# EAGLE design ethernet_board (EAGLE 7.2.0)
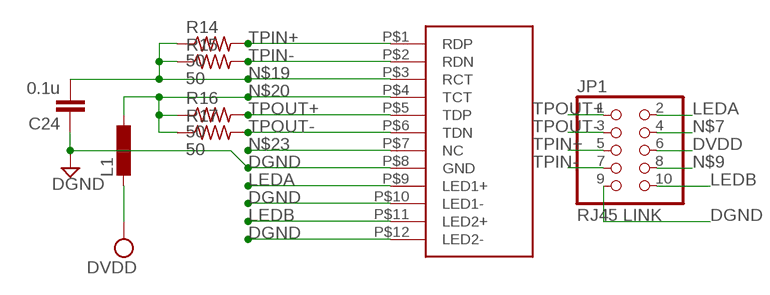
[diagram p0: schematic, sheet 1]

## Parts
C24  0.1u  C-EUC0805  [C0805]
JP1  RJ45 LINK  PINHD-2X5/90  [2X05/90]
L1  L-EU0207/10  [0207/10]
R14  50  R-US_R1206  [R1206]
R15  50  R-US_R1206  [R1206]
R16  50  R-US_R1206  [R1206]
R17  50  R-US_R1206  [R1206]
U$5  RJ45  TYCO-RJ45  [TYCO-RJ45]

## Nets
DGND: C24.1 JP1.9 U$5.P$8(GND) U$5.P$10(LED1-) U$5.P$12(LED2-)
DVDD: JP1.6 L1.2
LEDA: JP1.2 U$5.P$9(LED1+)
LEDB: JP1.10 U$5.P$11(LED2+)
N$7: JP1.4
N$9: JP1.8
N$19: C24.2 R14.1 R15.1 U$5.P$3(RCT)
N$20: L1.1 R16.1 R17.1 U$5.P$4(TCT)
N$23: U$5.P$7(NC)
TPIN+: JP1.5 R14.2 U$5.P$1(RDP)
TPIN-: JP1.7 R15.2 U$5.P$2(RDN)
TPOUT+: JP1.1 R16.2 U$5.P$5(TDP)
TPOUT-: JP1.3 R17.2 U$5.P$6(TDN)

## Library data of the parts
C24 = rcl:C-EU: CAPACITOR, European symbol
JP1 = pinhead:PINHD-2X5: PIN HEADER
L1 = rcl:L-EU: INDUCTOR, European symbol
R14-R17 = rcl:R-US_: RESISTOR, American symbol
U$5 = Radio_IP_PCB:TYCO-RJ45

## Board
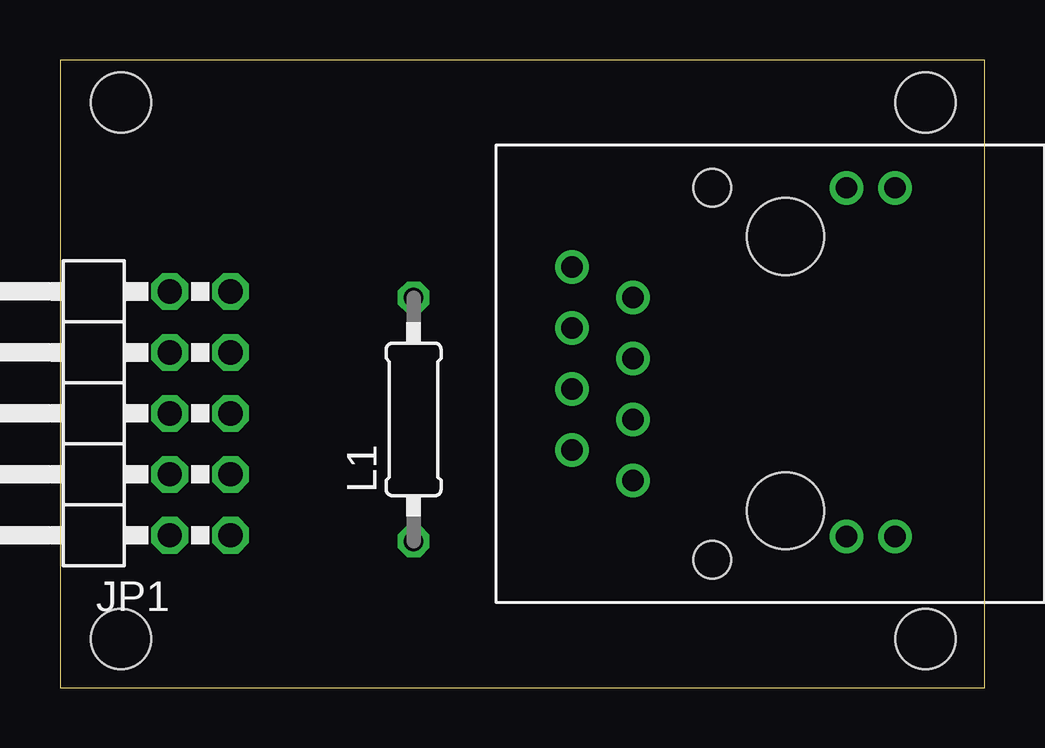
[diagram p1: board, top side]
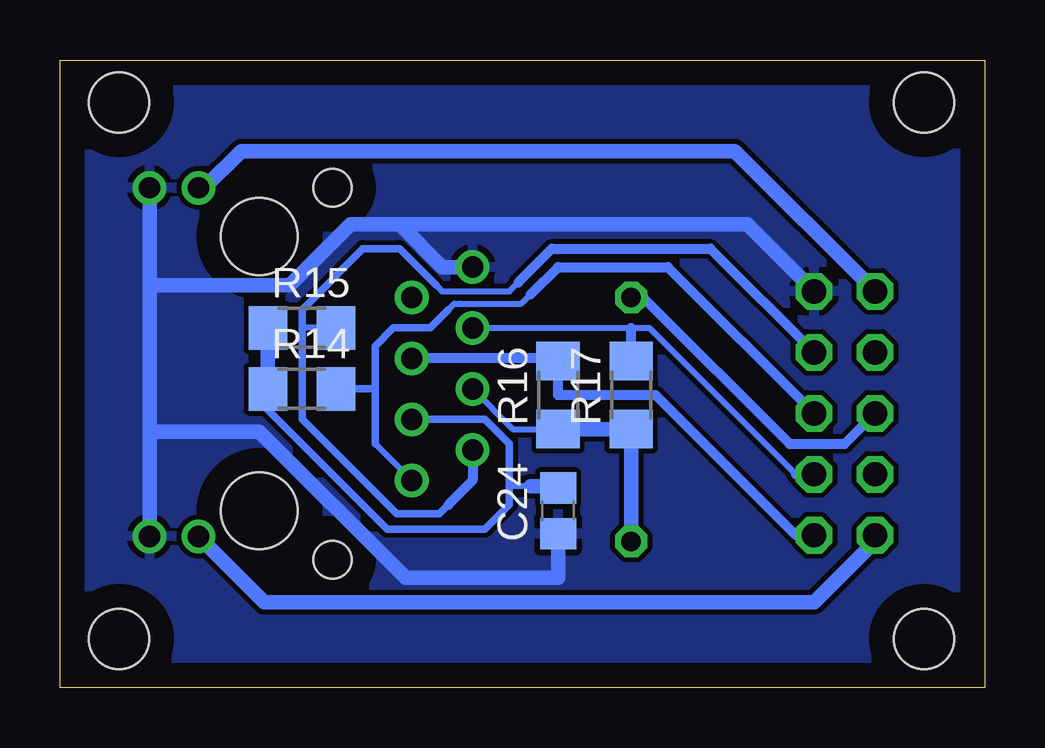
[diagram p2: board, bottom side, seen from below]

Size 38.53 x 26.15 mm. Coordinates in mm from the lower left corner, seen from the top.
Outline: 0,0 38.53,0 38.53,26.15 0,26.15 0,0
Copper layers (1*16): Top 0.035mm / dielectric 1.5mm / Bottom 0.035mm
Design rules "default": minimum track width 10mil, minimum drill 24mil, track to track 8mil, track to pad 8mil, pad to pad 8mil, via to via 8mil, smd to smd 8mil, copper to edge 40mil, drill to drill 8mil, minimum pad ring 10mil, minimum via ring 8mil, stop-mask expansion 4mil, vias tented up to drill 0mil, thermal gap 10mil
Holes 2.5 mm at 2.54,24.38 2.54,2.03 36.07,24.38 36.07,2.03

### Footprints (pad centres in the part's own frame; a part is rotated, then mirrored left to right if it is on the bottom)
C0805 = smd 1.3 x 1.5: 1 -0.95,0; 2 0.95,0
2X05/90 = drill 1.016 octagon: 1 -5.08,-6.35; 2 -5.08,-3.81; 3 -2.54,-6.35; 4 -2.54,-3.81; 5 0,-6.35; 6 0,-3.81; 7 2.54,-6.35; 8 2.54,-3.81; 9 5.08,-6.35; 10 5.08,-3.81
0207/10 = drill 0.813 octagon: 1 -5.08,0; 2 5.08,0
R1206 = smd 1.6 x 1.803: 1 -1.422,0; 2 1.422,0
TYCO-RJ45 = drill 0.889: P$1 0,0; P$2 1.27,2.54; P$3 2.54,0; P$4 3.81,2.54; P$5 5.08,0; P$6 6.35,2.54; P$7 7.62,0; P$8 8.89,2.54; P$9 -2.337,-8.89; P$10 -2.337,-10.922; P$11 12.192,-8.89; P$12 12.192,-10.922 | hole 3.2: -1.27,-6.35; 10.16,-6.35 | hole 1.575: -3.302,-3.302; 12.192,-3.302

### Placement (x,y rotation side)
C24  17.78,7.37 90 bottom
JP1  0.76,11.43 90 top
L1  14.73,11.18 90 top
R14  28.45,12.45 0 bottom
R15  28.45,14.99 0 bottom
R16  17.78,12.19 90 bottom
R17  14.73,12.19 90 bottom
U$5  23.88,8.64 90 top

### Tracks (layer width: path | path; a pad name or v marks a point on that pad's centre or on a via)
DGND
  Bottom 0.61: 34.8,16.76 34.8,10.67 | U$5.P$8 22.61,17.53 24.38,19.3 | 24.38,19.3 26.42,19.3 28.96,16.76 34.8,16.76 | C24.1 17.78,4.57 24.13,4.57 30.23,10.67 34.8,10.67 | JP1.9 9.91,19.3 24.38,19.3 | 34.8,16.76 U$5.P$12 | U$5.P$10 34.8,10.67
  pour Bottom: -0.51,26.42 39.12,26.42 39.12,-0.51 -0.51,-0.51 -0.51,23.88
DVDD
  Bottom 0.406: L1.2 14.22,16.26 8.13,10.16 5.84,10.16 JP1.6
LEDA
  Bottom 0.61: U$5.P$9 30.02,3.56 7.11,3.56 4.57,6.1 JP1.2
LEDB
  Bottom 0.61: JP1.10 10.41,22.35 30.99,22.35 32.51,20.83 U$5.P$11
N$19
  Bottom 0.254: 18.92,8.38 19.81,8.38
  Bottom 0.305: U$5.P$3 20.83,11.18 19.81,10.16 19.81,8.38 19.81,7.62 20.83,6.6 24.89,6.6 29.97,11.68 29.97,12.85 R14.1
  Bottom 0.61: R15.1 R14.1 | C24.2 17.78,8.38 18.92,8.38
N$20
  Bottom 0.254: U$5.P$4 19.66,10.77 R16.1
  Bottom 0.61: R16.1 R17.1 L1.1
TPIN+
  Bottom 0.254: U$5.P$1 25.4,10.16 | 18.92,16.38 19.3,16 21.84,16 22.1,16 22.35,15.75
  Bottom 0.305: 25.4,10.16 25.4,12.45 | 25.4,12.45 25.4,14.22 24.64,14.99 23.11,14.99 22.35,15.75 | R14.2 25.4,12.45
  Bottom 0.406: JP1.5 13.21,17.53 17.78,17.53 18.92,16.38
TPIN-
  Bottom 0.254: 22.86,16.76 22.61,16.51 19.81,16.51 19.43,16.89 | R15.2 28.45,14.99
  Bottom 0.305: 22.86,16.76 24.38,18.29 25.91,18.29 28.45,15.75 28.45,14.99 28.45,11.18 24.51,7.24 22.73,7.24 22.35,7.62
  Bottom 0.406: U$5.P$2 21.34,8.64 22.35,7.62 | JP1.7 11.43,18.29 18.03,18.29 19.43,16.89
TPOUT+
  Bottom 0.254: R16.2 17.78,13.72
  Bottom 0.406: 17.78,13.72 U$5.P$5 | JP1.1 7.87,6.35 13.72,12.19 17.78,12.19 R16.2
TPOUT-
  Bottom 0.254: U$5.P$6 14.73,14.99 13.97,14.99 7.87,8.89
  Bottom 0.406: JP1.3 7.87,8.89 | R17.2 14.73,14.99